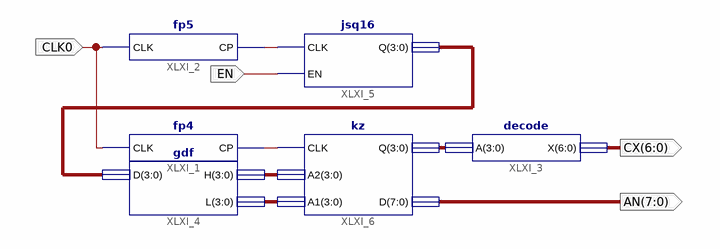
[diagram p0: schematic sheet 1]
// Xilinx ISE schematic main_06.sch (artix7) as structural Verilog: 6 symbols, 4 ports
module main_06 (
  input  EN,
  input  CLK0,
  output [7:0] AN,
  output [6:0] CX
);

  wire XLXN_1, XLXN_4;
  wire [3:0] XLXN_6, XLXN_7, XLXN_8, XLXN_9;

  fp4 XLXI_1 (.CLK(CLK0), .CP(XLXN_4));
  fp5 XLXI_2 (.CLK(CLK0), .CP(XLXN_1));
  decode XLXI_3 (.A(XLXN_8), .X(CX));
  gdf XLXI_4 (.D(XLXN_9), .H(XLXN_6), .L(XLXN_7));
  jsq16 XLXI_5 (.CLK(XLXN_1), .EN(EN), .Q(XLXN_9));
  kz XLXI_6 (.CLK(XLXN_4), .A2(XLXN_6), .A1(XLXN_7), .Q(XLXN_8), .D(AN));
endmodule
